# EAGLE design icsp (EAGLE 7.0.0)
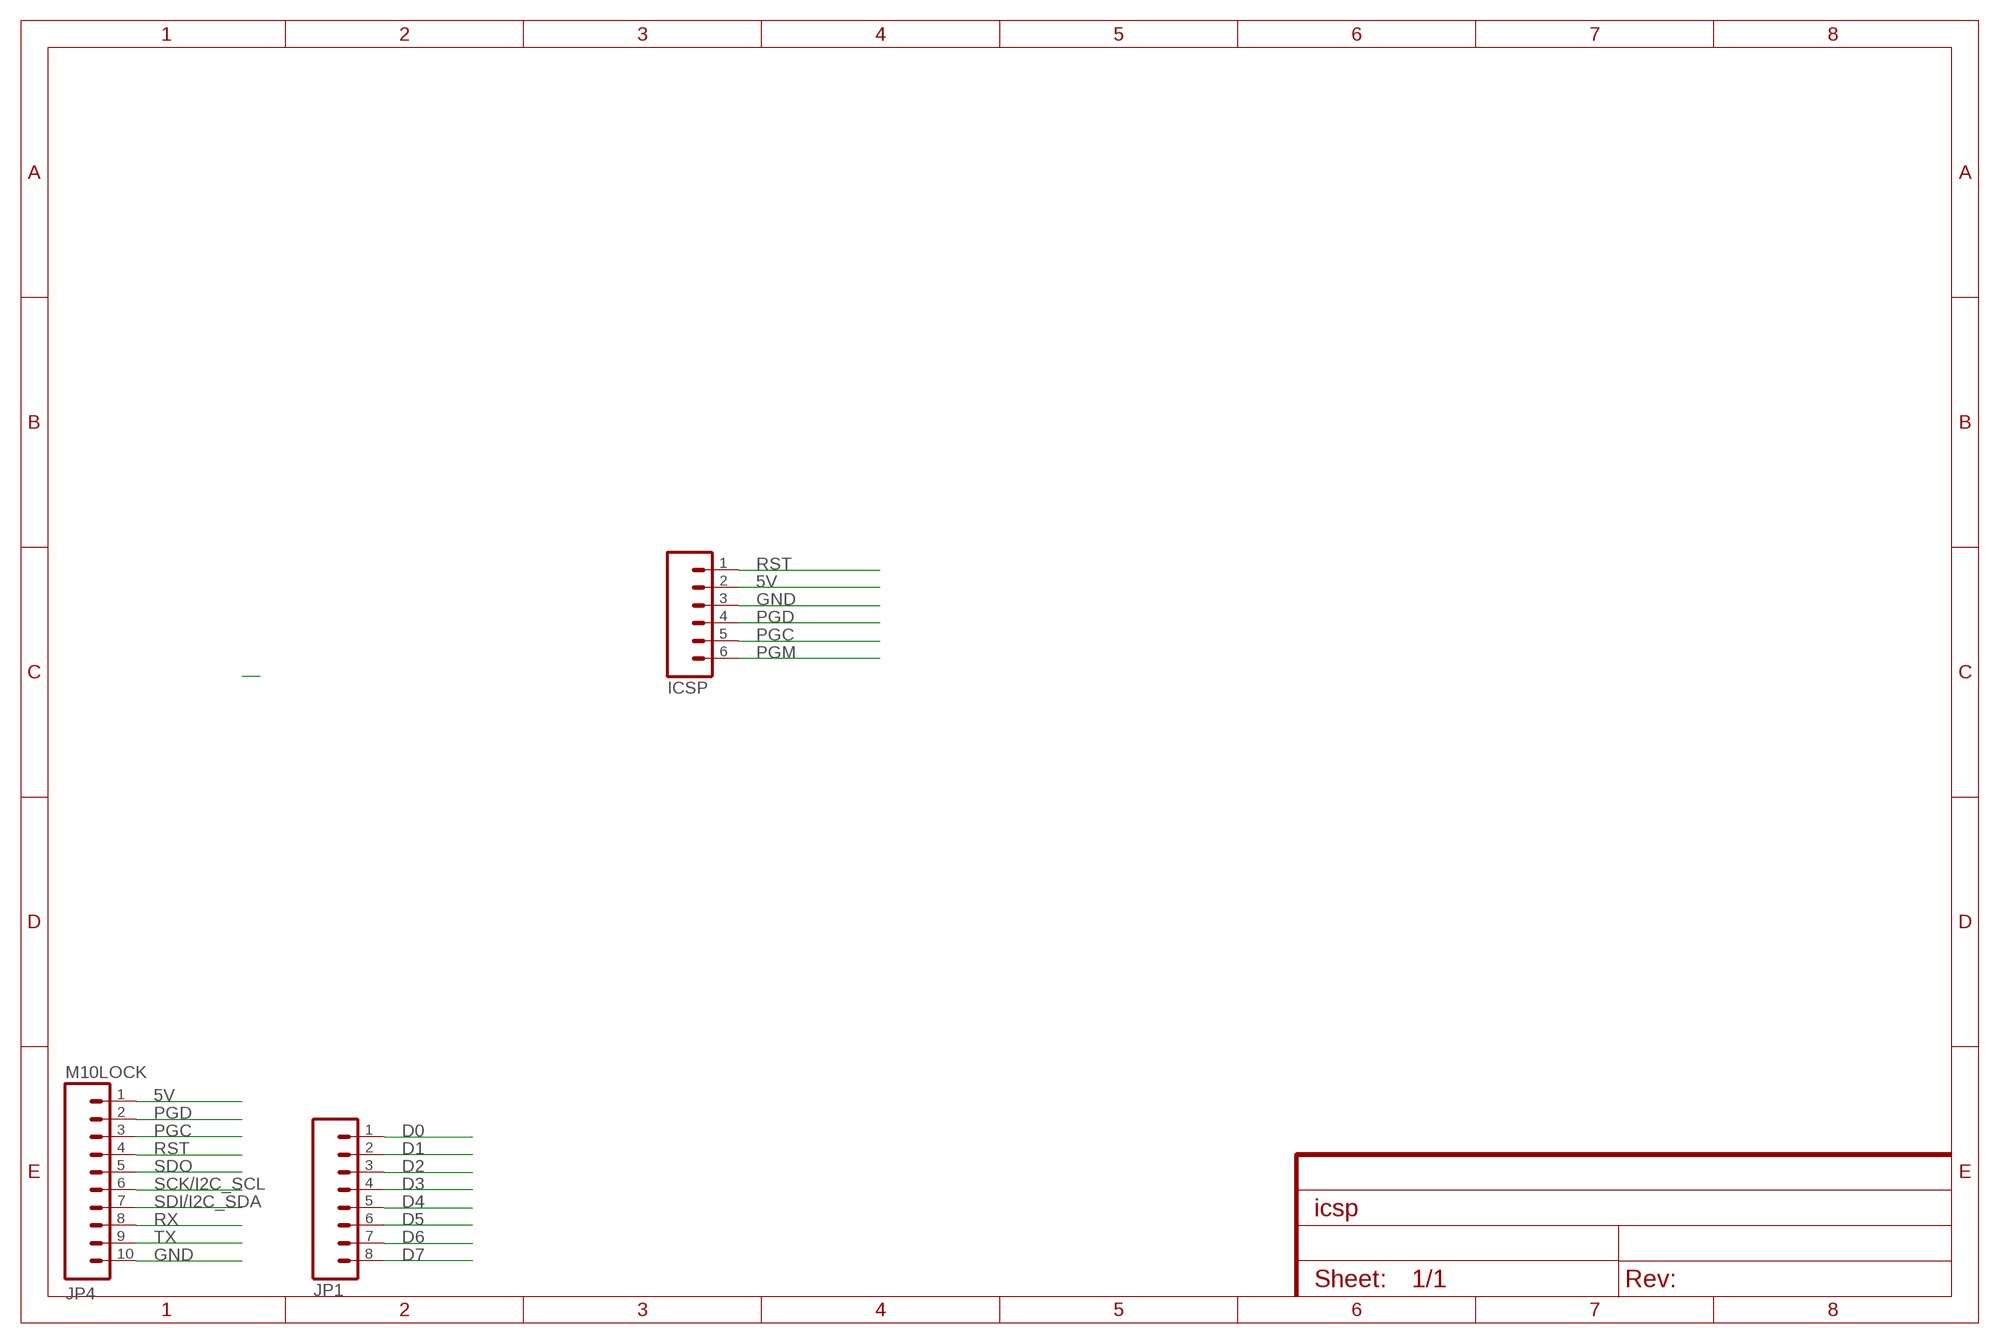
[diagram p0: schematic, sheet 1]

## Parts
ICSP  M06LOCK  [1X06_LOCK]
JP1  M08LOCK  [1X08_LOCK]
JP4  M10LOCK  [1X10_LOCK]

## Nets
5V: ICSP.2 JP4.1
D0: JP1.1
D1: JP1.2
D2: JP1.3
D3: JP1.4
D4: JP1.5
D5: JP1.6
D6: JP1.7
D7: JP1.8
GND: ICSP.3 JP4.10
PGC: ICSP.5 JP4.3
PGD: ICSP.4 JP4.2
PGM: ICSP.6
RST: ICSP.1 JP4.4
RX: JP4.8
SCK/I2C_SCL: JP4.6
SDI/I2C_SDA: JP4.7
SDO: JP4.5
TX: JP4.9

## Library data of the parts
ICSP = SparkFun-Connectors:M06: Header 6 Standard 6-pin 0.1" header. Use with straight break away headers (SKU : PRT-00116), right angle break away headers (PRT-00553), swiss pins (PRT-00743), machine pins (PRT-00117), and female headers (PRT-00115). Molex polarized connector foot print use with SKU : PRT-08094 with associated crimp pins and housings. NOTES ON THE VARIANTS LOCK and LOCK_LONGPADS... This footprint was designed to help hold the alignment of a through-hole component (i.e. 6-pin header) while soldering it into place. You may notice that each hole has been shifted either up or down by 0.005 of an inch from it's more standard position (which is a perfectly straight line). This slight alteration caused the pins (the squares in the middle) to touch the edges of the holes. Because they are alternating, it causes a "brace" to hold the component in place. 0.005 has proven to be the perfect amount of "off-center" position when using our standard breakaway headers. Although looks a little odd when you look at the bare footprint, once you have a header in there, the alteration is very hard to notice. Also,if you push a header all the way into place, it is covered up entirely on the bottom side. This idea of altering the position of holes to aid alignment will be further integrated into the Sparkfun Library for other footprints. It can help hold any component with 3 or more connection pins.
JP1 = SparkFun-Connectors:M08: Header 8 Standard 8-pin 0.1" header. Use with straight break away headers (SKU : PRT-00116), right angle break away headers (PRT-00553), swiss pins (PRT-00743), machine pins (PRT-00117), and female headers (PRT-00115).
JP4 = SparkFun-Connectors:M10: Header 10 Standard 10-pin 0.1" header. Use with straight break away headers (SKU : PRT-00116), right angle break away headers (PRT-00553), swiss pins (PRT-00743), machine pins (PRT-00117), and female headers (PRT-00115).

## Board
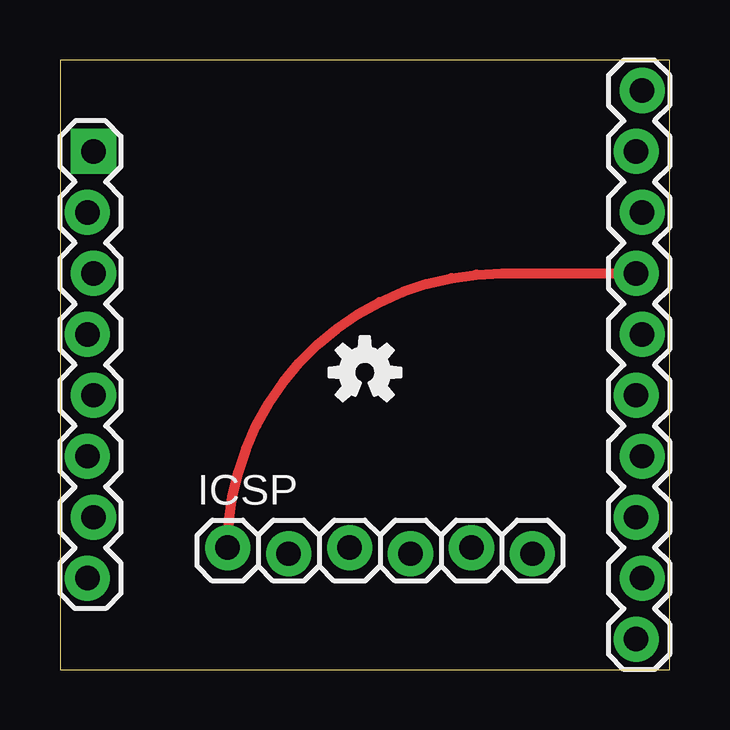
[diagram p1: board, top side]
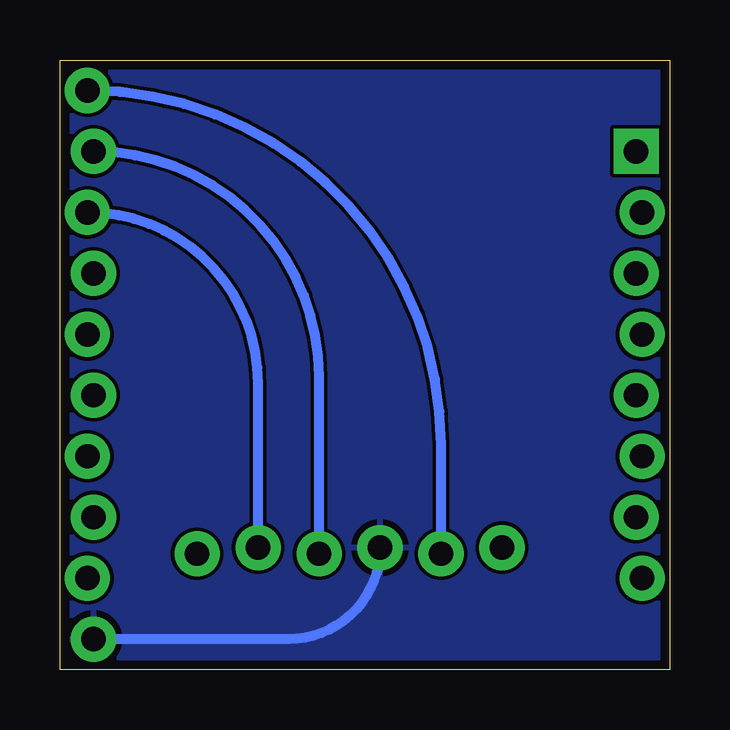
[diagram p2: board, bottom side, seen from below]

Size 25.4 x 25.4 mm. Coordinates in mm from the lower left corner, seen from the top.
Outline: 0,0 25.4,0 25.4,25.4 0,25.4 0,0
Copper layers (1*16): Top 0.0356mm / dielectric 1.5011mm / Bottom 0.0356mm
Design rules "LaenPCBOrder": minimum track width 6mil, minimum drill 13mil, track to track 6mil, track to pad 6mil, pad to pad 6mil, via to via 6mil, smd to smd 6mil, copper to edge 15mil, drill to drill 6mil, minimum pad ring 7mil, minimum via ring 7mil, stop-mask expansion 3mil, vias tented up to drill 0mil, thermal gap 10mil

### Footprints (pad centres in the part's own frame; a part is rotated, then mirrored left to right if it is on the bottom)
1X06_LOCK = drill 1.016 pad 1.88: 1 0,0; 2 2.54,-0.254; 3 5.08,0; 4 7.62,-0.254; 5 10.16,0; 6 12.7,-0.254
1X08_LOCK = drill 1.016 pad 1.88 square: 1 0,0.127 | drill 1.016 pad 1.88: 2 2.54,-0.127; 3 5.08,0.127; 4 7.62,-0.127; 5 10.16,0.127; 6 12.7,-0.127; 7 15.24,0.127; 8 17.78,-0.127
1X10_LOCK = drill 1.016 pad 1.88: 1 0,0.127; 2 2.54,-0.127; 3 5.08,0.127; 4 7.62,-0.127; 5 10.16,0.127; 6 12.7,-0.127; 7 15.24,0.127; 8 17.78,-0.127; 9 20.32,0.127; 10 22.86,-0.127

### Placement (x,y rotation side)
ICSP  6.99,5.08 0 top
JP1  1.27,21.59 270 top
JP4  24.13,24.13 270 top
U$1  [OSHW-LOGO-S]  12.7,12.38 0 top

### Tracks (layer width: path | path; a pad name or v marks a point on that pad's centre or on a via)
5V
  Bottom 0.406: ICSP.2 9.53,9.4 arc-90 JP4.1
GND
  Bottom 0.406: ICSP.3 arc90 15.88,1.27 JP4.10
  pour Bottom: 0,25.4 25.4,25.4 25.4,0 0,0
PGC
  Bottom 0.406: ICSP.5 17.14,11.94 arc-90 JP4.3
PGD
  Bottom 0.406: ICSP.4 14.61,12.19 arc-90 JP4.2
RST
  Top 0.406: ICSP.1 arc-90 18.41,16.51 JP4.4